# EAGLE design SJH-5XDMount.sch (EAGLE 9.6.2)
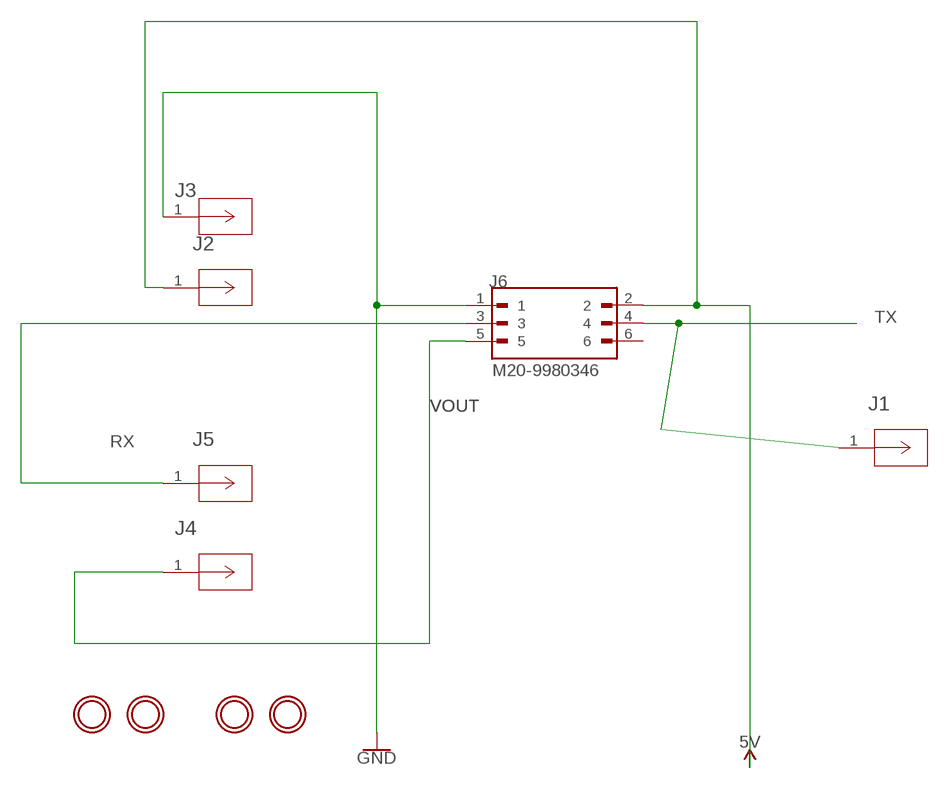
[diagram p0: schematic, sheet 1]

## Parts
J1  450-3326-01-03-00  [CONN_450-3326-01-XX-00_CBN]
J2  450-3326-01-03-00  [CONN_450-3326-01-XX-00_CBN]
J3  450-3326-01-03-00  [CONN_450-3326-01-XX-00_CBN]
J4  450-3326-01-03-00  [CONN_450-3326-01-XX-00_CBN]
J5  450-3326-01-03-00  [CONN_450-3326-01-XX-00_CBN]
J6  M20-9980346  [HARWIN_M20-9980346]
U$1  MOUNTINGHOLE2.5  [MOUNTINGHOLE_2.5_PLATED]
U$2  MOUNTINGHOLE2.5  [MOUNTINGHOLE_2.5_PLATED]
U$3  MOUNTINGHOLE2.5  [MOUNTINGHOLE_2.5_PLATED]
U$4  MOUNTINGHOLE2.5  [MOUNTINGHOLE_2.5_PLATED]

## Nets
5V: J2.1 J6.2
GND: J3.1 J6.1
RX: J5.1 J6.3
TX: J1.1 J6.4
VOUT: J4.1 J6.5
Unconnected: J6.6

## Library data of the parts
J1-J5 = Methane:450-3326-01-03-00; COPYRIGHT: Copyright (C) 2024 Ultra Librarian. All rights reserved.; MANUFACTURER_PART_NUMBER: 450-3326-01-03-00; MFR_NAME: Cambion
J6 = M20-9980346:M20-9980346; MANUFACTURER: HARWIN; STANDARD: Manufacturer Recommendations
U$1-U$4 = microbuilder:MOUNTINGHOLE: Mounting Hole For #2 screws (0.086"/2.18mm width, 0.094"/2.4mm hole) use 2.5mm

## Board
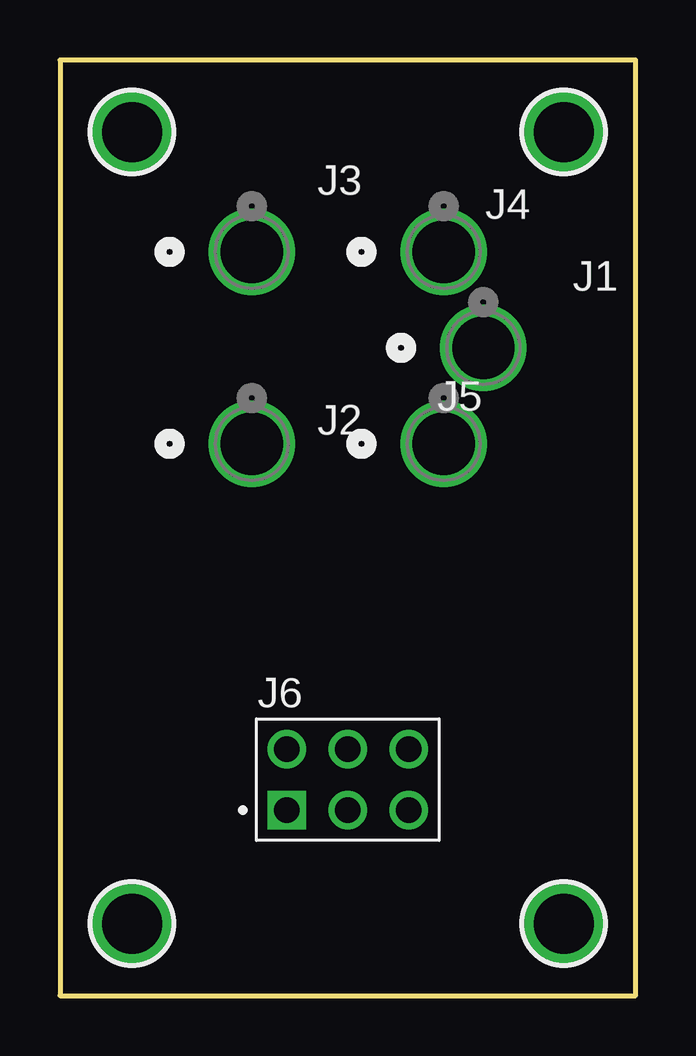
[diagram p1: board, top side]
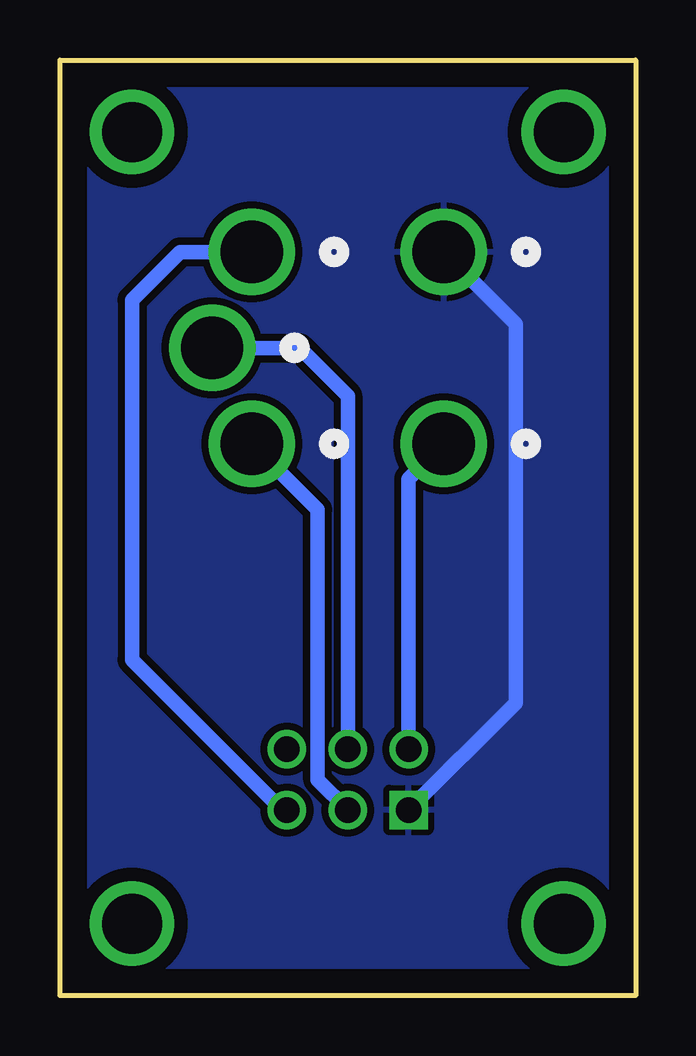
[diagram p2: board, bottom side, seen from below]

Size 24 x 39 mm. Coordinates in mm from the lower left corner, seen from the top.
Outline: 0,0 24,0 24,39 0,39 0,0
Copper layers (1*16): Top 0.035mm / dielectric 1.5mm / Bottom 0.035mm
Design rules "default": minimum track width 6mil, minimum drill 0.35mm, track to track 6mil, track to pad 6mil, pad to pad 6mil, via to via 6mil, smd to smd 6mil, copper to edge 40mil, drill to drill 6mil, minimum pad ring 10mil, minimum via ring 8mil, stop-mask expansion 4mil, vias tented up to drill 0mil, thermal gap 10mil

### Footprints (pad centres in the part's own frame; a part is rotated, then mirrored left to right if it is on the bottom)
CONN_450-3326-01-XX-00_CBN = drill 2.591 pad 3.099: 1 0,0
HARWIN_M20-9980346 = drill 1.07 square: 1 -2.54,-1.27 | drill 1.07: 2 -2.54,1.27; 3 0,-1.27; 4 0,1.27; 5 2.54,-1.27; 6 2.54,1.27
MOUNTINGHOLE_2.5_PLATED = drill 2.5 pad 3.2: P$1 0,0

### Placement (x,y rotation side)
J1  17.65,27 0 top
J2  8,23 0 top
J3  8,31 0 top
J4  16,31 0 top
J5  16,23 0 top
J6  12,9 0 top
U$1  3,3 0 top
U$2  21,3 0 top
U$3  3,36 0 top
U$4  21,36 0 top

### Tracks (layer width: path | path; a pad name or v marks a point on that pad's centre or on a via)
5V
  Bottom 0.61: J2.1 9.46,21.54 J6.2
GND
  Bottom 0.61: J6.1 5,12.19 5,28 J3.1
  pour Bottom (isolate 0.3): 1,38 23,38 23,1 1,1
RX
  Bottom 0.61: J6.3 13.26,8.99 13.26,20.26 J5.1
TX
  Bottom 0.61: J1.1 14,27 12,25 J6.4
VOUT
  Bottom 0.61: J4.1 19,31 21,29 21,14 14.73,7.73 J6.5